# EAGLE design tinyblick (EAGLE 8.4.3)
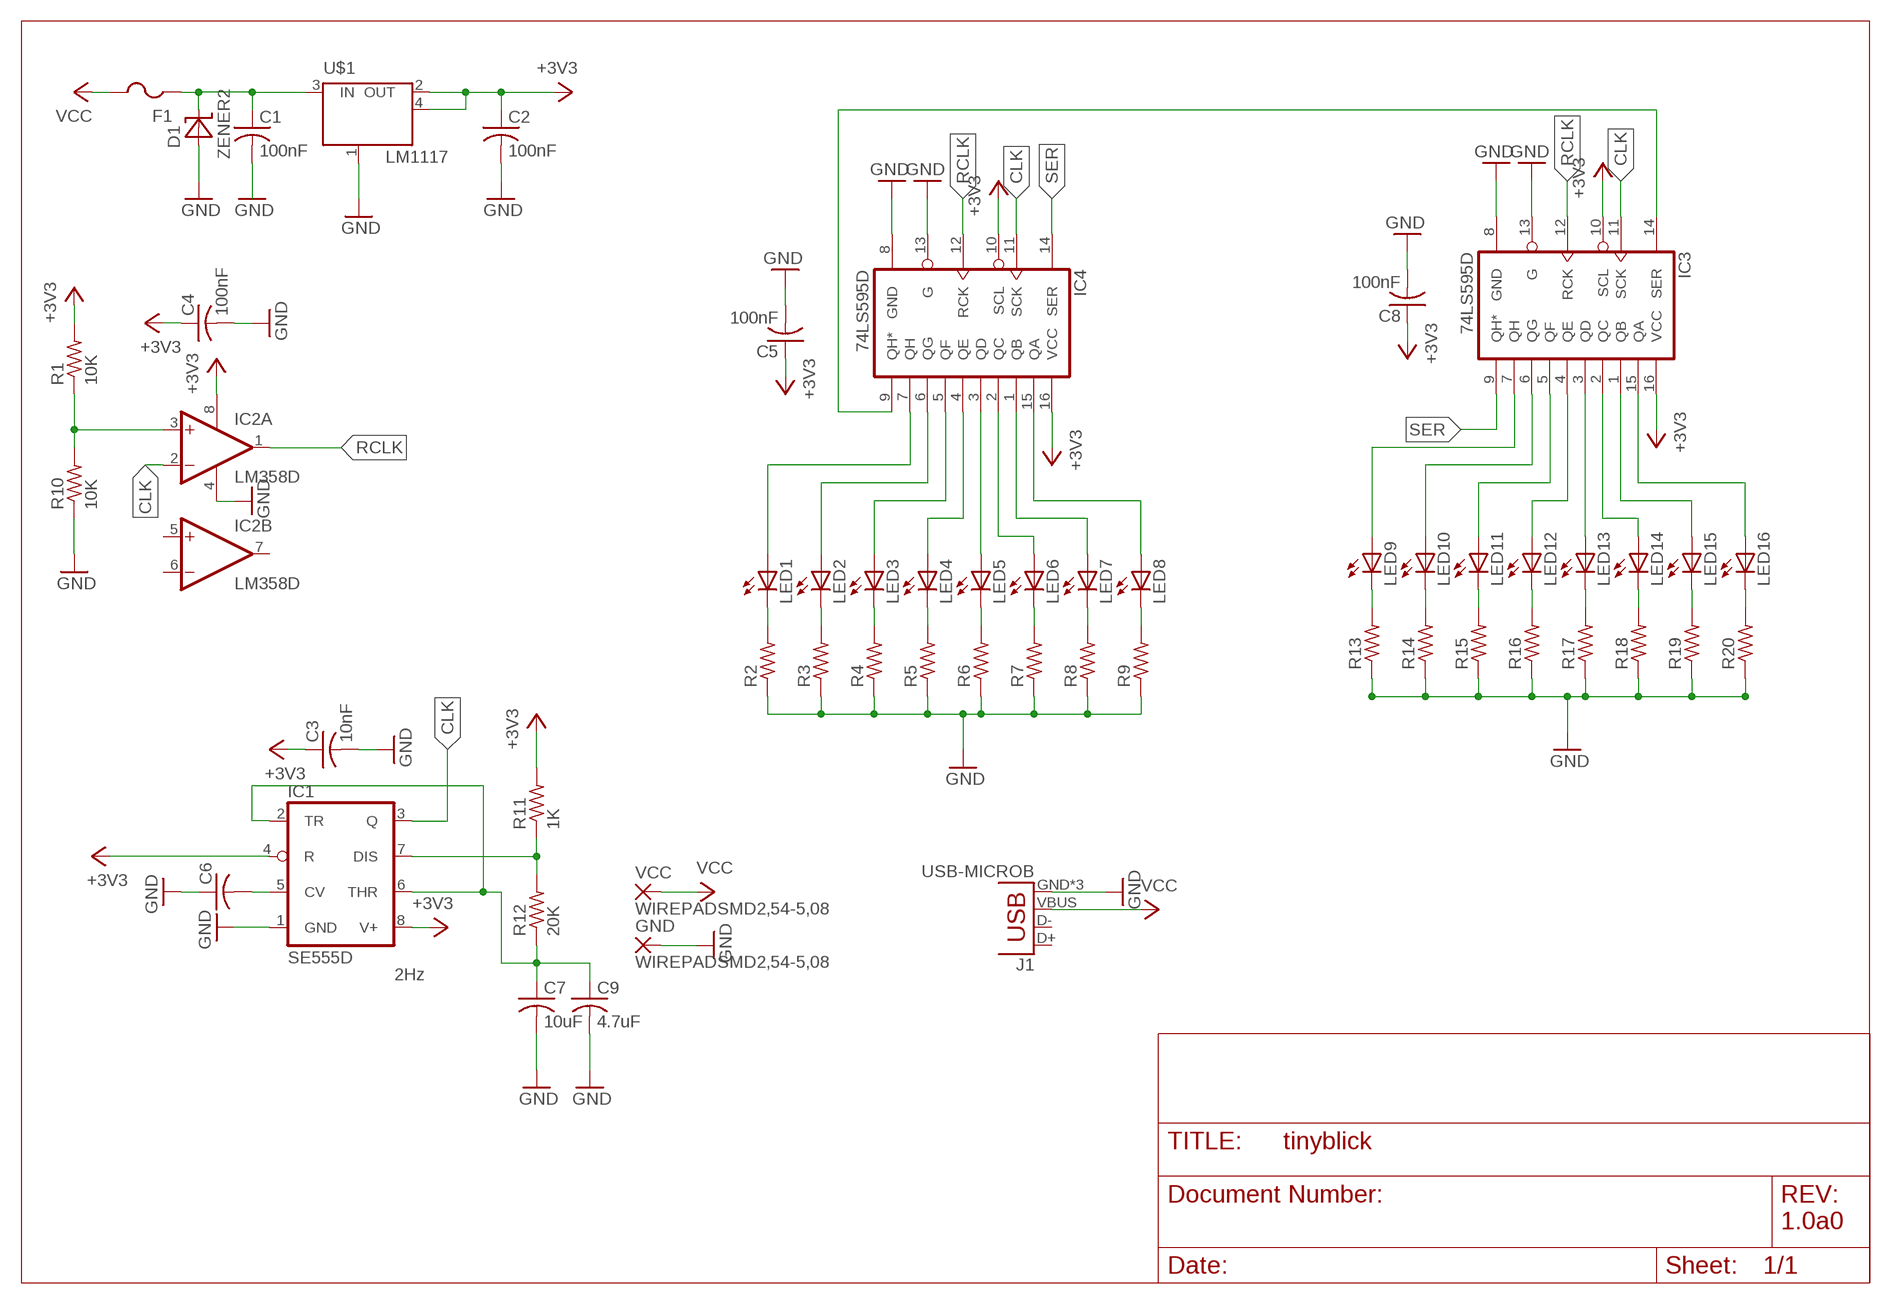
[diagram p0: schematic, sheet 1]

## Parts
C1  100nF  C-USC0603  [C0603]
C2  100nF  C-USC0603  [C0603]
C3  10nF  C-USC0603  [C0603]
C4  100nF  C-USC0603  [C0603]
C5  100nF  C-USC0603  [C0603]
C6  C-USC0603  [C0603]
C7  10uF  C-USC0603  [C0603]
C8  100nF  C-USC0603  [C0603]
C9  4.7uF  C-USC0603  [C0603]
D1  ZENER2  [SOD123]
F1  PTCFUSE-1206  [R1206]
GND  WIREPADSMD2,54-5,08  [SMD2,54-5,08]
IC1  SE555D  [SO08]
IC2  LM358D  [SO08]
IC3  74LS595D  [SO16]
IC4  74LS595D  [SO16]
J1  USB-MICROB  [USB-MICROB]
LED1  LEDCHIP-LED0603  [CHIP-LED0603]
LED2  LEDCHIP-LED0603  [CHIP-LED0603]
LED3  LEDCHIP-LED0603  [CHIP-LED0603]
LED4  LEDCHIP-LED0603  [CHIP-LED0603]
LED5  LEDCHIP-LED0603  [CHIP-LED0603]
LED6  LEDCHIP-LED0603  [CHIP-LED0603]
LED7  LEDCHIP-LED0603  [CHIP-LED0603]
LED8  LEDCHIP-LED0603  [CHIP-LED0603]
LED9  LEDCHIP-LED0603  [CHIP-LED0603]
LED10  LEDCHIP-LED0603  [CHIP-LED0603]
LED11  LEDCHIP-LED0603  [CHIP-LED0603]
LED12  LEDCHIP-LED0603  [CHIP-LED0603]
LED13  LEDCHIP-LED0603  [CHIP-LED0603]
LED14  LEDCHIP-LED0603  [CHIP-LED0603]
LED15  LEDCHIP-LED0603  [CHIP-LED0603]
LED16  LEDCHIP-LED0603  [CHIP-LED0603]
R1  10K  R-US_R0603  [R0603]
R2  R-US_R0603  [R0603]
R3  R-US_R0603  [R0603]
R4  R-US_R0603  [R0603]
R5  R-US_R0603  [R0603]
R6  R-US_R0603  [R0603]
R7  R-US_R0603  [R0603]
R8  R-US_R0603  [R0603]
R9  R-US_R0603  [R0603]
R10  10K  R-US_R0603  [R0603]
R11  1K  R-US_R0603  [R0603]
R12  20K  R-US_R0603  [R0603]
R13  R-US_R0603  [R0603]
R14  R-US_R0603  [R0603]
R15  R-US_R0603  [R0603]
R16  R-US_R0603  [R0603]
R17  R-US_R0603  [R0603]
R18  R-US_R0603  [R0603]
R19  R-US_R0603  [R0603]
R20  R-US_R0603  [R0603]
U$1  LM1117  [SOT223]
VCC  WIREPADSMD2,54-5,08  [SMD2,54-5,08]

## Nets
+3V3: C2.1 C3.1 C4.1 C5.1 C8.1 IC1.4(R) IC1.8(V+) IC2.8(P:V+) IC3.10(SCL) IC3.16(VCC) IC4.10(SCL) IC4.16(VCC) R1.2 R11.2 U$1.2(OUT) U$1.4(OUT)
CLK: IC1.3(Q) IC2.2(A:-IN) IC3.11(SCK) IC4.11(SCK)
GND: C1.2 C2.2 C3.2 C4.2 C5.2 C6.1 C7.2 C8.2 C9.2 D1.A GND.1(P) IC1.1(GND) IC2.4(P:V-) IC3.8(GND) IC3.13(G) IC4.8(GND) IC4.13(G) J1.GND J1.MT1(GND) J1.MT2(GND) R2.1 R3.1 R4.1 R5.1 R6.1 R7.1 R8.1 R9.1 R10.1 R13.1 R14.1 R15.1 R16.1 R17.1 R18.1 R19.1 R20.1 U$1.1(GND/ADJ)
N$1: LED1.C R2.2
N$3: IC1.7(DIS) R11.1 R12.2
N$4: LED2.C R3.2
N$6: C7.1 C9.1 IC1.2(TR) IC1.6(THR) R12.1
N$7: LED3.C R4.2
N$9: LED9.C R13.2
N$10: LED4.C R5.2
N$13: LED5.C R6.2
N$15: IC4.3(QD) LED5.A
N$16: LED6.C R7.2
N$18: IC4.2(QC) LED6.A
N$19: LED7.C R8.2
N$21: IC4.1(QB) LED7.A
N$22: LED8.C R9.2
N$24: IC4.15(QA) LED8.A
N$25: IC4.7(QH) LED1.A
N$26: IC2.3(A:+IN) R1.1 R10.2
N$27: C1.1 D1.C F1.1 U$1.3(IN)
N$28: IC4.6(QG) LED2.A
N$29: IC4.5(QF) LED3.A
N$30: C6.2 IC1.5(CV)
N$31: LED10.C R14.2
N$33: LED11.C R15.2
N$34: IC4.4(QE) LED4.A
N$36: LED12.C R16.2
N$38: LED13.C R17.2
N$45: IC3.3(QD) LED13.A
N$46: LED14.C R18.2
N$48: IC3.2(QC) LED14.A
N$49: LED15.C R19.2
N$51: IC3.1(QB) LED15.A
N$52: LED16.C R20.2
N$54: IC3.15(QA) LED16.A
N$55: IC3.7(QH) LED9.A
N$56: IC3.6(QG) LED10.A
N$57: IC3.5(QF) LED11.A
N$58: IC3.4(QE) LED12.A
N$60: IC3.14(SER) IC4.9(QH*)
RCLK: IC2.1(A:OUT) IC3.12(RCK) IC4.12(RCK)
SER: IC3.9(QH*) IC4.14(SER)
VCC: F1.2 J1.VBUS VCC.1(P)
Unconnected: IC2.5(B:+IN) IC2.6(B:-IN) IC2.7(B:OUT) J1.D+ J1.D-

## Notes on the sheet
- 2Hz
- 1.0a0

## Library data of the parts
C1-C9 = adafruit:C-US: CAPACITOR, American symbol
D1 = smt_diodes:ZENER
F1 = adafruit:PTCFUSE: PTC fuses, resettable thermistors
GND VCC = wirepad:WIREPAD: Wire PAD connect wire on PCB
IC1 = adafruit:*555: TIMER Changed DIP package to have round (not oval) pin pads http://www.ladyada.net/library/pcb/eaglelibrary.html
IC2 = linear:LM358: OP AMP also LM158; LM258; LM2904 Source: http://cache.national.com/ds/LM/LM158.pdf
IC3 IC4 = SparkFun:74*595: 8-bit SHIFT REGISTER, output latch
J1 = SparkFun-Connectors:USB: USB Connectors USB-B-PTH is fully proven SKU : PRT-00139/CONN-08278 USB-miniB is fully proven SKU : PRT-00587 USB-A-PCB is untested. USB-A-H is throughly reviewed, but untested. Spark Fun Electronics SKU : PRT-00437 USB-B-SMT is throughly reviewed, but untested. Needs silkscreen touching up. USB-A-S has not been used/tested USB-MB-H has not been used/tested USB-MICROB has been used. CONN-09505; PROD_ID: CONN-09505
LED1-LED16 = led:LED: LED OSRAM: - CHIPLED LG R971, LG N971, LY N971, LG Q971, LY Q971, LO R971, LY R971 LH N974, LH R974 LS Q976, LO Q976, LY Q976 LO Q996 - Hyper CHIPLED LW Q18S LB Q993, LB Q99A, LB R99A - SideLED LS A670, LO A670, LY A670, LG A670, LP A670 LB A673, LV A673, LT A673, LW A673 LH A674 LY A675 LS A676, LA A676, LO A676, LY A676, LW A676 LS A679, LY A679, LG A679 - Hyper Micro SIDELED® LS Y876, LA Y876, LO Y876, LY Y876 LT Y87S - SmartLED LW L88C, LW L88S LB L89C, LB L89S, LG L890 LS L89K, LO L89K, LY L89K LS L896, LA L896, LO L896, LY L896 - TOPLED LS T670, LO T670, LY T670, LG T670, LP T670 LSG T670, LSP T670, LSY T670, LOP T670, LYG T670 LG T671, LOG T671, LSG T671 LB T673, LV T673, LT T673, LW T673 LH T674 LS T676, LA T676, LO T676, LY T676, LB T676, LH T676, LSB T676, LW T676 LB T67C, LV T67C, LT T67C, LS T67K, LO T67K, LY T67K, LW E67C LS E67B, LA E67B, LO E67B, LY E67B, LB E67C, LV E67C, LT E67C LW T67C LS T679, LY T679, LG T679 LS T770, LO T770, LY T770, LG T770, LP T770 LB T773, LV T773, LT T773, LW T773 LH T774 LS E675, LA E675, LY E675, LS T675 LS T776, LA T776, LO T776, LY T776, LB T776 LHGB T686 LT T68C, LB T68C - Hyper Mini TOPLED® LB M676 - Mini TOPLED Santana® LG M470 LS M47K, LO M47K, LY M47K Source: http://www.osram.convergy.de LUXEON: - LUMILED® LXK2-PW12-R00, LXK2-PW12-S00, LXK2-PW14-U00, LXK2-PW14-V00 LXK2-PM12-R00, LXK2-PM12-S00, LXK2-PM14-U00 LXK2-PE12-Q00, LXK2-PE12-R00, LXK2-PE12-S00, LXK2-PE14-T00, LXK2-PE14-U00 LXK2-PB12-K00, LXK2-PB12-L00, LXK2-PB12-M00, LXK2-PB14-N00, LXK2-PB14-P00, LXK2-PB14-Q00 LXK2-PR12-L00, LXK2-PR12-M00, LXK2-PR14-Q00, LXK2-PR14-R00 LXK2-PD12-Q00, LXK2-PD12-R00, LXK2-PD12-S00 LXK2-PH12-R00, LXK2-PH12-S00 LXK2-PL12-P00, LXK2-PL12-Q00, LXK2-PL12-R00 Source: www.luxeon.com KINGBRIGHT: KA-3528ASYC Source: www.kingbright.com
R1-R20 = adafruit:R-US_: RESISTOR, American symbol
U$1 = voltage_regulators:LM1117

## Board
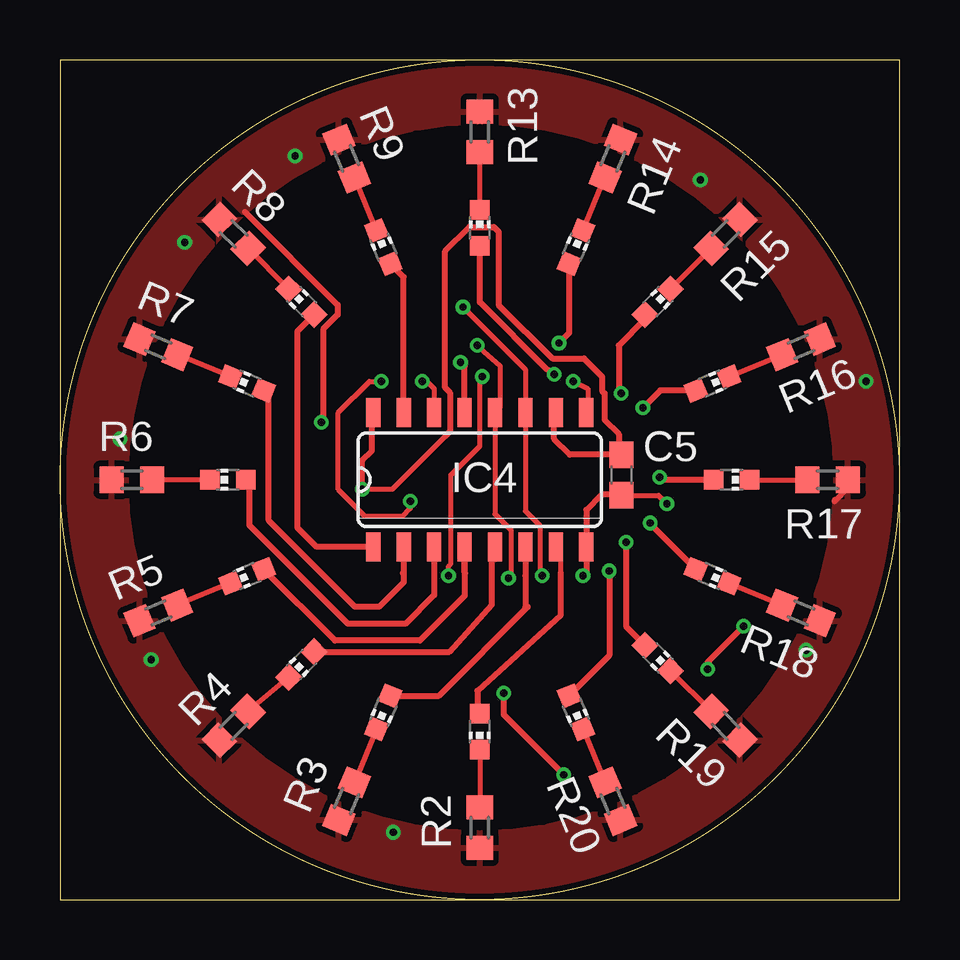
[diagram p1: board, top side]
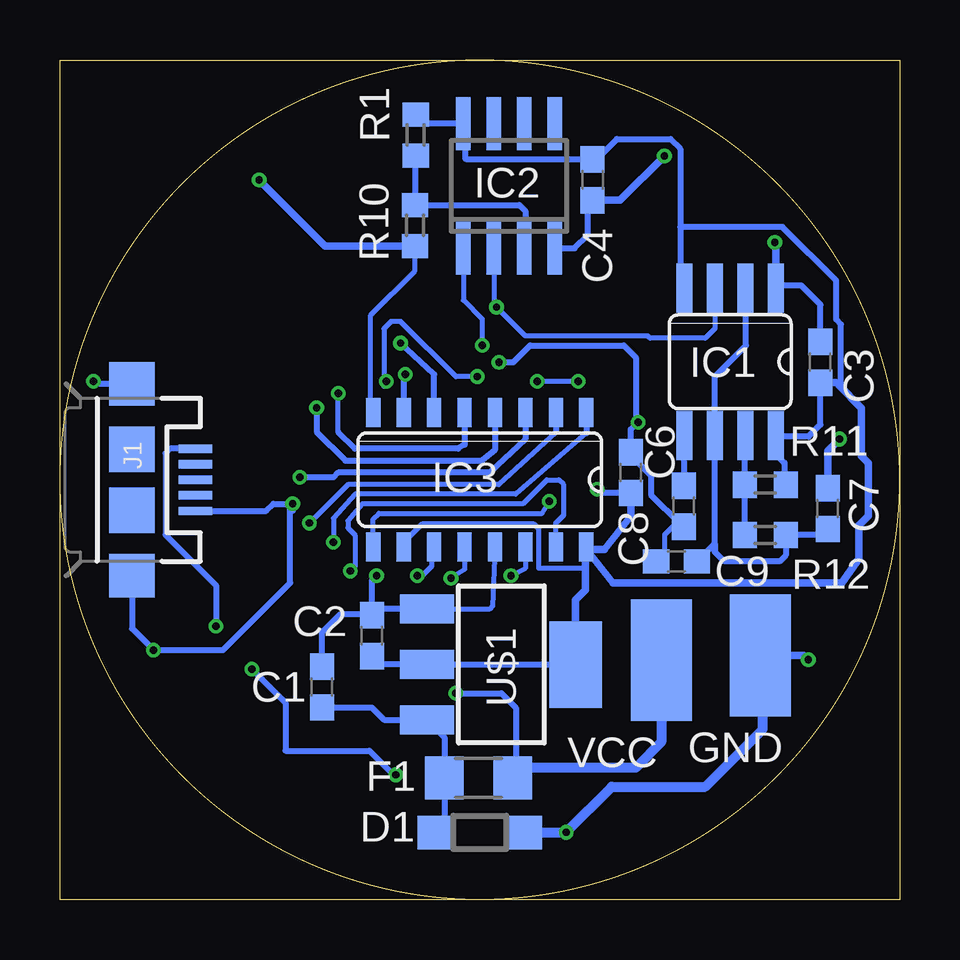
[diagram p2: board, bottom side, seen from below]

Size 35 x 35 mm. Coordinates in mm from the lower left corner, seen from the top.
Outline: 0,0 35,0 35,35 0,35 0,0
Outline: circle at 17.5,17.5 radius 17.5
Copper layers (1*16): Top 0.035mm / dielectric 1.5mm / Bottom 0.035mm
Design rules "ITEADstudioDRC *": minimum track width 10mil, minimum drill 12mil, track to track 6mil, track to pad 6mil, pad to pad 6mil, via to via 6mil, smd to smd 0mil, copper to edge 10mil, drill to drill 10mil, minimum pad ring 10mil, minimum via ring 6mil, stop-mask expansion 2mil, vias tented up to drill 13mil, thermal gap 10mil

### Footprints (pad centres in the part's own frame; a part is rotated, then mirrored left to right if it is on the bottom)
C0603 = smd 1.1 x 1: 1 -0.85,0; 2 0.85,0
SOD123 = smd 1.4 x 1.4: A 1.9,0; C -1.9,0
R1206 = smd 1.6 x 1.803: 1 -1.422,0; 2 1.422,0
SMD2,54-5,08 = smd 2.54 x 5.08: 1 0,0
SO08 = smd 0.66 x 2.032: 1 -1.905,-3.073; 2 -0.635,-3.073; 3 0.635,-3.073; 4 1.905,-3.073; 5 1.905,3.073; 6 0.635,3.073; 7 -0.635,3.073; 8 -1.905,3.073
SO08' = smd 0.6 x 2.2: 1 -1.905,-2.6; 2 -0.635,-2.6; 3 0.635,-2.6; 4 1.905,-2.6; 5 1.905,2.6; 6 0.635,2.6; 7 -0.635,2.6; 8 -1.905,2.6
SO16 = smd 0.6 x 1.2: 1 -4.445,-2.8; 2 -3.175,-2.8; 3 -1.905,-2.8; 4 -0.635,-2.8; 5 0.635,-2.8; 6 1.905,-2.8; 7 3.175,-2.8; 8 4.445,-2.8; 9 4.445,2.8; 10 3.175,2.8; 11 1.905,2.8; 12 0.635,2.8; 13 -0.635,2.8; 14 -1.905,2.8; 15 -3.175,2.8; 16 -4.445,2.8
USB-MICROB = smd 0.35 x 1.4: D+ 0,2.65; D- -0.65,2.65; GND 1.3,2.65; ID 0.65,2.65; VBUS -1.3,2.65 | smd 1.8 x 1.9: MT1 -4,0; MT2 4,0 | smd 1.9 x 1.9: P$1 -1.27,0; P$2 1.27,0
CHIP-LED0603 = smd 0.8 x 0.8: A 0,-0.75; C 0,0.75
R0603 = smd 1 x 1.1: 1 -0.85,0; 2 0.85,0
SOT223 = smd 1.219 x 2.235: 1 -2.311,-3.099; 2 0,-3.099; 3 2.311,-3.099 | smd 3.6 x 2.2: 4 0,3.099

### Placement (x,y rotation side)
C1  24.07,8.86 90 bottom
C2  22,11 90 bottom
C3  3.3,22.4 90 bottom
C4  12.8,30 270 bottom
C5  23.4,17.7 270 top
C6  9,16.4 90 bottom
C7  3,16.3 90 bottom
C8  11.2,17.8 90 bottom
C9  9.3,14.1 180 bottom
D1  17.5,2.8 0 bottom
F1  17.55,5.07 0 bottom
GND  5.81,10.18 0 bottom
IC1  7.06,22.42 180 bottom
IC2  LM358D  [SO08']  16.28,29.75 0 bottom
IC3  17.5,17.5 180 bottom
IC4  17.5,17.5 0 top
J1  32,17.5 270 bottom
LED1  17.5,7 180 top
LED2  13.48,7.8 157.5 top
LED3  10.07,9.8 135 top
LED4  7.8,13.48 112.5 top
LED5  7,17.5 90 top
LED6  7.8,21.51 67.5 top
LED7  10.07,24.92 45 top
LED8  13.48,27.2 22.5 top
LED9  17.5,28 0 top
LED10  21.51,27.2 337.5 top
LED11  24.92,24.92 315 top
LED12  27.2,21.51 292.5 top
LED13  28,17.5 270 top
LED14  27.2,13.48 247.5 top
LED15  24.92,10.07 225 top
LED16  21.51,7.8 202.5 top
R1  20.17,31.87 90 bottom
R2  17.5,3 90 top
R3  11.95,4.1 67.5 top
R4  7.24,7.24 45 top
R5  4.1,11.95 22.5 top
R6  3,17.5 0 top
R7  4.1,23.04 337.5 top
R8  7.24,27.75 315 top
R9  11.95,30.89 292.5 top
R10  20.2,28.1 90 bottom
R11  5.6,17.3 0 bottom
R12  5.6,15.2 180 bottom
R13  17.5,32 270 top
R14  23.05,30.89 247.5 top
R15  27.75,27.75 225 top
R16  30.89,23.04 202.5 top
R17  32,17.5 180 top
R18  30.89,11.95 157.5 top
R19  27.75,7.24 135 top
R20  23.05,4.1 112.5 top
U$1  16.6,9.8 270 bottom
VCC  9.93,9.98 0 bottom

### Tracks (layer width: path | path; a pad name or v marks a point on that pad's centre or on a via)
+3V3  (via drill 0.3)
  Top 0.203: IC4.10 20.7,20.32 | 16.26,19.51 13.85,17.1 v12.6,17.1
  Top 0.254: v12.6,17.1 12.6,18.3 13,18.7 13,20.25 IC4.16 | 16.05,19.3 16.26,19.51 16.26,21.13 16.05,21.34 16.05,27.03 17.07,28.04 18.09,28.04 18.29,27.84 18.29,24.79 20.52,22.55 21.84,22.55 22.6,21.8 22.6,21.2 22.7,21.1 22.7,20 23.3,19.4 23.3,18.65 C5.1 21.25,18.55 20.6,19.2 20.6,20.23 IC4.10
  Bottom 0.203: 13.1,13.82 15.04,13.82 15.04,15.44 15.24,15.65 19.91,15.65 20.73,14.83
  Bottom 0.254: C2.1 21.65,9.8 U$1.2 U$1.4 12.7,9.8 | C3.1 3.3,19.8 3.8,19.3 5.11,19.3 IC1.8 5.16,18.55 4.8,18.2 4.8,17.35 R11.2 | 20.25,32.8 R1.2 19.8,32.35 IC2.8 18.1,32.27 18.1,30.9 18.05,30.85 C4.1 12.6,30.89 11.79,31.7 9.55,31.7 9.14,31.29 9.14,28.04 | C8.1 12.45,16.95 v12.6,17.1 | 9.14,28.04 9.14,25.6 IC1.4 | 20.73,14.83 IC3.10 | 9.14,28.04 4.88,28.04 2.64,25.81 2.64,24.18 2.44,23.98 2.44,21.54 2.54,21.44
  Bottom 0.305: U$1.4 13.5,12.5 13.1,12.9 13.1,13.82 13.1,14.64 | 13.1,14.64 IC3.16 | C8.1 11.2,16 12.3,14.6 13.05,14.6 | 13.05,14.6 13.1,14.64 | C3.1 2.65,21.55 2.54,21.44 1.6,20.5 1.6,18.5 1.3,18.2 1.3,16 1.7,15.6 1.7,14.2 2.4,13.2 11.96,13.2 13.05,14.6
CLK  (via drill 0.3)
  Top 0.203: v16.8,24.7 19.41,22.09 IC4.11 19.41,16.2 20,15.6 20,13.6 v20.1,13.5
  Bottom 0.203: IC1.3 7.7,23.8 8.1,23.4 10.4,23.4 10.5,23.5 15.6,23.5 v16.8,24.7 16.91,24.82 IC2.2 | v20.1,13.5 19.9,13.5 19.5,13.9 19.5,14.7 IC3.11
  Bottom 0.254: 7.71,25.51 IC1.3
GND  (via drill 0.3)
  Top 0.203: C5.2 24.95,16.85 v25.3,16.5
  Top 0.254: v21.8,13.5 21.95,13.64 IC4.8 21.95,16.25 22.6,16.9 23.35,16.9 C5.2 23.57,16.66 | v10.9,19.9 10.97,19.91 10.97,23.77 11.58,24.38 11.58,24.79 7.72,28.65 7.7,28.67 | 32.31,16.66 32.3,16.6 32.85,17.15 R17.1 | IC4.13 16.86,22.23 v16.7,22.4
  Bottom 0.203: IC3.13 16.96,12.23 17.1,12.1 19.69,12.1 U$1.1 | IC3.8 22.05,20.4 22.05,24.36 20.2,26.2 R10.1 | C6.1 9.45,15.55 9.8,15.2 9.8,14.25 C9.2
  Bottom 0.254: U$1.1 21.74,12.11 C2.2 | C1.2 24.07,11.13 23.3,11.9 22.05,11.9 C2.2 | C4.2 13,28.95 13,27.7 13.55,27.15 IC2.4 14.36,27.13 | C3.2 3.3,24.8 4.1,25.6 5.05,25.6 IC1.1 | C2.2 22,13.3 v21.8,13.5 | C6.1 9.14,15.65 10.36,16.87 10.36,17.68 11.18,18.49 C8.2 11.2,19.6 v10.9,19.9 11,20 11,22.6 11.5,23.1 15.4,23.1 16.1,22.4 v16.7,22.4 | 25.3,16.4 v25.3,16.5 26.1,16.5 26.4,16.2 J1.GND | 25.3,16.4 25.3,16.2 | J1.MT2 32,11.3 v31.1,10.4 28.2,10.4 25.4,13.2 25.4,16.3 25.3,16.4 | J1.MT1 33.5,21.5 v33.6,21.6
  Bottom 0.305: GND.1 3.98,10.18 v3.8,10 | IC1.1 5.16,27.36 v5.2,27.4 | C4.2 11.65,29.15 v9.8,31 | C7.2 3,18.7 v2.5,19.2 | R10.1 23.95,27.25 v26.7,30
  Bottom 0.406: D1.A v13.9,2.8 12,4.7 8.1,4.7 5.7,7.1 5.7,10.07 GND.1
  pour Top: -0.6,35 36.1,35 36.1,-0.2 -0.6,-0.2
N$1
  Top 0.203: LED1.C R2.2
N$3
  Bottom 0.254: IC1.7 6.45,19.32 R11.1 R12.2
N$4
  Top 0.203: LED2.C R3.2
N$5
  cutout Top: 17.5,32.2 arc-90 32.1,17.5 arc-90 17.5,3 arc-90 3,17.5 arc-90
N$6
  Bottom 0.254: C7.1 3.25,15.2 R12.1 4.75,14.35 5,14.1 7.3,14.1 7.7,14.5 7.7,14.85 | 7.7,14.85 IC1.6 7.7,21.8 6.4,23.1 6.4,25.47 IC1.2 | C9.1 7.7,14.85
N$7
  Top 0.203: LED3.C R4.2
N$9
  Top 0.203: LED9.C R13.2
N$10
  Top 0.203: LED4.C R5.2
N$13
  Top 0.203: LED5.C R6.2
N$15
  Top 0.254: IC4.3 15.6,13.51 | 15.6,13.51 15.6,13.5 | 15.6,13.51 15.6,12.7 14.4,11.5 12,11.5 7.9,15.6 7.9,17.35 LED5.A
N$16
  Top 0.203: LED6.C R7.2
N$18
  Top 0.254: IC4.2 14.32,13.62 | 14.32,13.62 14.3,13.6 | 14.32,13.62 14.32,13.22 13.3,12.2 12.3,12.2 8.7,15.8 8.7,21.02 LED6.A
N$19
  Top 0.203: LED7.C R8.2
N$21
  Top 0.254: IC4.1 10.7,14.7 9.9,15.5 9.9,23.69 LED7.A
N$22
  Top 0.203: LED8.C R9.2
N$24
  Top 0.254: IC4.15 14.32,25.95 LED8.A
N$25
  Top 0.203: 20.88,13.62 20.88,14.5 IC4.7
  Top 0.254: 20.88,13.62 20.88,11.88 17.4,8.7 17.4,7.85 LED1.A
N$26
  Bottom 0.254: R1.1 20.2,30.99 R10.2 15.85,28.95 15.6,28.7 15.6,27.2 IC2.3
N$27
  Bottom 0.254: D1.C 18.97,3.23 F1.1 18.97,6.76 U$1.3 21.5,7.5 22.01,8.01 C1.1
N$28
  Top 0.254: IC4.6 19.41,13.51 | 19.41,13.51 19.4,13.5 | LED2.A 15.79,8.49 19.5,12.2 | 19.5,12.2 | 19.41,13.51 19.41,12.19 | 19.41,12.19 19.41,12.11 19.4,12.1 | 19.41,12.19 19.51,12.19 19.5,12.2
N$29
  Top 0.254: IC4.5 18.14,14.2 18,14.16 18,12.3 16.23,10.33 LED3.A
N$30
  Bottom 0.254: IC1.5 9,19.35 C6.2
N$31
  Top 0.203: LED10.C R14.2
N$33
  Top 0.203: LED11.C R15.2
N$34
  Top 0.254: 16.9,13.6 16.86,13.63 IC4.4 16.86,12.66 15,10.8 11.46,10.8 LED4.A
N$36
  Top 0.203: LED12.C R16.2
N$38
  Top 0.203: LED13.C R17.2
N$45  (via drill 0.3)
  Top 0.254: LED13.A 25.1,17.5 v25,17.6
  Bottom 0.254: IC3.3 15.6,19.2 17.1,17.8 23.4,17.8 23.6,17.6 v25,17.6
N$46
  Top 0.203: LED14.C R18.2
N$48  (via drill 0.3)
  Top 0.254: v24.6,15.7 24.6,15.67 LED14.A
  Bottom 0.203: 16.7,17.3 23,17.3 v24.6,15.7
  Bottom 0.208: 14.32,19.48 16.7,17.3
  Bottom 0.254: IC3.2 14.32,19.48
N$49
  Top 0.203: LED15.C R19.2
N$51  (via drill 0.3)
  Top 0.254: v23.6,14.9 23.6,11.39 LED15.A
  Bottom 0.203: v23.6,14.9 23.6,15.9 22.7,16.9 16,16.9 13.05,19.45
  Bottom 0.254: IC3.1 13.05,19.45
N$52
  Top 0.203: LED16.C R20.2
N$54  (via drill 0.3)
  Top 0.254: v22.9,13.7 22.9,10.17 LED16.A
  Bottom 0.203: 22.7,13.9 22.7,15.2 23,15.5 23,15.8 22.4,16.5 15.7,16.5 14.7,17.5 14.2,17.5 14,17.3 14,16.02 14.32,15.7 IC3.15
  Bottom 0.254: 22.7,13.9 v22.9,13.7
N$55  (via drill 0.3)
  Top 0.254: v20.6,21.9 20.3,22.1 17.5,24.9 LED9.A
  Bottom 0.254: IC3.7 20.68,21.73 20.6,21.8 v20.6,21.9 20.6,22
N$56  (via drill 0.3)
  Top 0.254: LED10.A 21.22,23.62 v20.8,23.2
  Bottom 0.254: IC3.6 19.41,21.91 v20.8,23.2
N$57  (via drill 0.3)
  Top 0.254: LED11.A 24.39,24.19 23.3,23.1 23.3,21.2 v23.4,21.1
  Bottom 0.203: 23.4,19.5 v23.4,21.1
  Bottom 0.254: IC3.5 18.14,18.96 18.4,18.8 22.7,18.8 23.4,19.5 | v23.4,21.1 23.4,21.2
N$58  (via drill 0.3)
  Top 0.254: LED12.A 25.02,21.22 v24.3,20.5
  Bottom 0.254: IC3.4 16.86,18.73 17.4,18.3 23.1,18.3 24.3,19.5 v24.3,20.5
N$60  (via drill 0.3)
  Top 0.203: v16.2,13.5 16.2,13.9 16.3,14 16.3,17.7 17.5,18.9 17.5,21.7 v17.6,21.8 | v21.4,21.6 22,21.3 22,20.36 IC4.9
  Bottom 0.203: IC3.14 15.6,13.8 v16.2,13.5 | v17.6,21.8 18.5,21.8 20.8,24.1 21.2,24.1 21.5,23.8 21.5,21.4 v21.4,21.6
RCLK  (via drill 0.3)
  Top 0.203: v17.4,23.1 17.5,23.2 17.5,23 18.34,22.27 18.34,20.5 IC4.12 18.14,16.07 18.8,15.4 18.8,13.5 v18.7,13.4
  Bottom 0.203: IC2.1 18.18,24.98 17.4,24.2 v17.4,23.1 | IC3.12 18.14,13.77 v18.7,13.4
SER  (via drill 0.3)
  Top 0.203: v13.4,21.6 12.9,21.6 11.6,20.3 11.6,17.1 12.7,16 14.3,16 14.6,16.3 v14.6,16.6 | v15.1,21.6 15.3,21.6 15.6,21.3 IC4.14
  Bottom 0.203: IC3.9 21.95,15.86 21.7,16.1 14.9,16.1 v14.6,16.6 | v13.4,21.6 v15.1,21.6 15.2,21.5
VCC  (via drill 0.3)
  Top 0.254: v28.5,11.4 27,9.9 v27,9.6 | v21,5.2 18.5,7.7 v18.5,8.6
  Bottom 0.254: J1.VBUS 30.4,18.8 30.6,18.6 30.6,15.2 28.5,13.1 v28.5,11.4 | v27,9.6 25.6,8.2 25.6,6.2 22.1,6.2 21,5.1 v21,5.2 | v18.5,8.6 16.6,8.6 16,8 16,5.2
  Bottom 0.406: VCC.1 9.93,6.57 11,5.5 15.7,5.5 16,5.2 F1.2